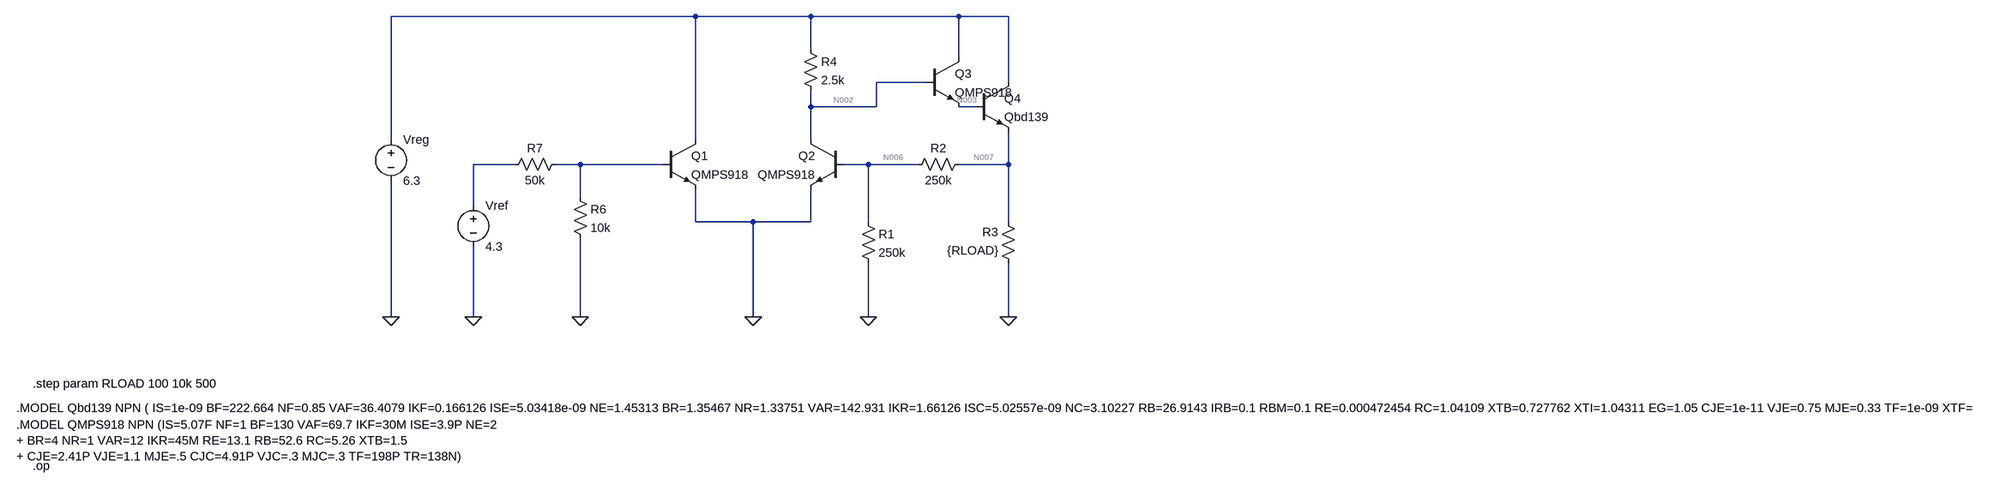
[diagram p0: schematic ReguladorTension-1ite.asc]
ReguladorTension-1ite.asc, the LTspice schematic file:
Version 4
SHEET 1 4348 848
WIRE 64 -96 -528 -96
WIRE 288 -96 64 -96
WIRE 576 -96 288 -96
WIRE 672 -96 576 -96
WIRE 288 -32 288 -96
WIRE 576 -16 576 -96
WIRE 512 32 416 32
WIRE 672 32 672 -96
WIRE 288 80 288 48
WIRE 416 80 416 32
WIRE 416 80 288 80
WIRE 608 80 576 80
WIRE -528 144 -528 -96
WIRE 64 144 64 -96
WIRE 288 144 288 80
WIRE -288 192 -368 192
WIRE -160 192 -208 192
WIRE 0 192 -160 192
WIRE 400 192 352 192
WIRE 496 192 400 192
WIRE 672 192 672 128
WIRE 672 192 576 192
WIRE -160 256 -160 192
WIRE -368 272 -368 192
WIRE 64 304 64 240
WIRE 176 304 64 304
WIRE 288 304 288 240
WIRE 288 304 176 304
WIRE 400 304 400 192
WIRE 672 304 672 192
WIRE -528 496 -528 224
WIRE -368 496 -368 352
WIRE -160 496 -160 336
WIRE 176 496 176 304
WIRE 400 496 400 384
WIRE 672 496 672 384
FLAG 176 496 0
FLAG 672 496 0
FLAG 400 496 0
FLAG -368 496 0
FLAG -528 496 0
FLAG -160 496 0
DATAFLAG 384 -96 ""
DATAFLAG 656 192 ""
DATAFLAG -32 192 "$-V(N008)"
DATAFLAG 368 192 "$-V(N008)"
DATAFLAG 672 0 "$-V(N006)"
SYMBOL npn 0 144 R0
SYMATTR InstName Q1
SYMATTR Value QMPS918
SYMBOL npn 352 144 M0
SYMATTR InstName Q2
SYMATTR Value QMPS918
SYMBOL res 384 288 R0
SYMATTR InstName R1
SYMATTR Value 250k
SYMBOL res 592 176 R90
WINDOW 0 0 56 VBottom 2
WINDOW 3 32 56 VTop 2
SYMATTR InstName R2
SYMATTR Value 250k
SYMBOL res 688 400 R180
WINDOW 0 36 76 Left 2
WINDOW 3 36 40 Left 2
SYMATTR InstName R3
SYMATTR Value {RLOAD}
SYMBOL npn 608 32 R0
SYMATTR InstName Q4
SYMATTR Value Qbd139
SYMBOL voltage -368 256 R0
WINDOW 123 0 0 Left 0
WINDOW 39 0 0 Left 0
SYMATTR InstName Vref
SYMATTR Value 4.3
SYMBOL voltage -528 128 R0
WINDOW 123 0 0 Left 0
WINDOW 39 0 0 Left 0
SYMATTR InstName Vreg
SYMATTR Value 6.3
SYMBOL res 272 -48 R0
SYMATTR InstName R4
SYMATTR Value 2.5k
SYMBOL res -176 240 R0
SYMATTR InstName R6
SYMATTR Value 10k
SYMBOL res -192 176 R90
WINDOW 0 0 56 VBottom 2
WINDOW 3 32 56 VTop 2
SYMATTR InstName R7
SYMATTR Value 50k
SYMBOL npn 512 -16 R0
SYMATTR InstName Q3
SYMATTR Value QMPS918
TEXT -1256 720 Left 2 !.MODEL Qbd139 NPN ( IS=1e-09 BF=222.664 NF=0.85 VAF=36.4079 IKF=0.166126 ISE=5.03418e-09 NE=1.45313 BR=1.35467 NR=1.33751 VAR=142.931 IKR=1.66126 ISC=5.02557e-09 NC=3.10227 RB=26.9143 IRB=0.1 RBM=0.1 RE=0.000472454 RC=1.04109 XTB=0.727762 XTI=1.04311 EG=1.05 CJE=1e-11 VJE=0.75 MJE=0.33 TF=1e-09 XTF=1 VTF=10 ITF=0.01 CJC=1e-11 VJC=0.75 MJC=0.33 XCJC=0.9 FC=0.5 CJS=0 VJS=0.75 MJS=0.5 TR=1e-07 PTF=0 KF=0 AF=1)
TEXT -1224 832 Left 2 !.op
TEXT -1256 752 Left 2 !.MODEL QMPS918 NPN (IS=5.07F NF=1 BF=130 VAF=69.7 IKF=30M ISE=3.9P NE=2\n+ BR=4 NR=1 VAR=12 IKR=45M RE=13.1 RB=52.6 RC=5.26 XTB=1.5\n+ CJE=2.41P VJE=1.1 MJE=.5 CJC=4.91P VJC=.3 MJC=.3 TF=198P TR=138N)
TEXT -1224 672 Left 2 !.step param RLOAD 100 10k 500

The netlist it stands for:
* ReguladorTension-1ite.asc
Q1 N001 N005 0 0 QMPS918
Q2 N002 N006 0 0 QMPS918
R1 N006 0 250k
R2 N007 N006 250k
R3 0 N007 {RLOAD}
Q4 N001 N003 N007 0 Qbd139
Vref N004 0 4.3
Vreg N001 0 6.3
R4 N001 N002 2.5k
R6 N005 0 10k
R7 N005 N004 50k
Q3 N001 N002 N003 0 QMPS918
.model NPN NPN
.model PNP PNP
.lib standard.bjt
.MODEL Qbd139 NPN ( IS=1e-09 BF=222.664 NF=0.85 VAF=36.4079 IKF=0.166126 ISE=5.03418e-09 NE=1.45313 BR=1.35467 NR=1.33751 VAR=142.931 IKR=1.66126 ISC=5.02557e-09 NC=3.10227 RB=26.9143 IRB=0.1 RBM=0.1 RE=0.000472454 RC=1.04109 XTB=0.727762 XTI=1.04311 EG=1.05 CJE=1e-11 VJE=0.75 MJE=0.33 TF=1e-09 XTF=1 VTF=10 ITF=0.01 CJC=1e-11 VJC=0.75 MJC=0.33 XCJC=0.9 FC=0.5 CJS=0 VJS=0.75 MJS=0.5 TR=1e-07 PTF=0 KF=0 AF=1)
.op
.MODEL QMPS918 NPN (IS=5.07F NF=1 BF=130 VAF=69.7 IKF=30M ISE=3.9P NE=2
+ BR=4 NR=1 VAR=12 IKR=45M RE=13.1 RB=52.6 RC=5.26 XTB=1.5
+ CJE=2.41P VJE=1.1 MJE=.5 CJC=4.91P VJC=.3 MJC=.3 TF=198P TR=138N)
.step param RLOAD 100 10k 500
.backanno
.end

* Results of the author's LTspice run, read from the files saved beside the schematic
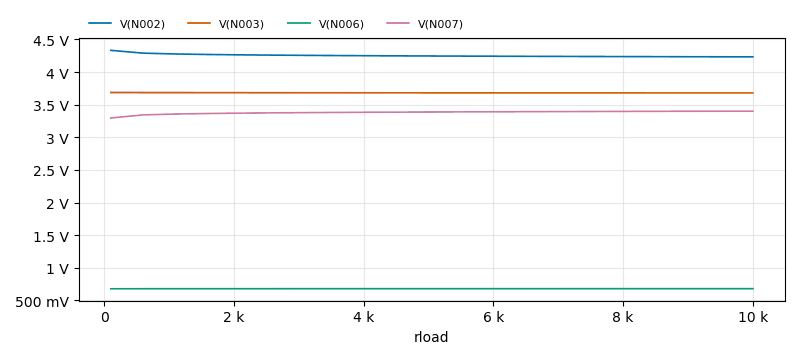
[diagram p1: Operating Point of ReguladorTension-1ite.asc, plotted from the saved traces]
* Operating Point, 1 run:
*   V(N002): 4.333 V at rload=100 , 4.233 V at rload=10 k, min 4.233 V, max 4.333 V
*   V(N003): 3.687 V at rload=100 , 3.68 V at rload=10 k, min 3.68 V, max 3.687 V
*   V(N006): 677.9 mV at rload=100 , 680 mV at rload=10 k, min 677.9 mV, max 680 mV
*   V(N007): 3.296 V at rload=100 , 3.401 V at rload=10 k, min 3.296 V, max 3.401 V
* From the log:
*   Semiconductor Device Operating Points:
*                           --- Bipolar Transistors ---
*   Name:       q4          q3          q2          q1
*   Model:    qbd139      qmps918     qmps918     qmps918
*   Ib:       2.96e-04    3.28e-06    7.76e-06    5.91e-06
*   Ic:       3.27e-02    2.92e-04    7.84e-04    5.98e-04
*   Vbe:      3.91e-01    6.46e-01    6.78e-01    6.67e-01
*   Vbc:     -2.61e+00   -1.97e+00   -3.65e+00   -5.63e+00
*   Vce:      3.00e+00    2.61e+00    4.33e+00    6.30e+00
*   BetaDC:   1.11e+02    8.90e+01    1.01e+02    1.01e+02
*   Gm:       1.29e+00    1.12e-02    2.95e-02    2.26e-02
*   Rpi:      9.15e+01    9.22e+03    3.70e+03    4.94e+03
*   Rx:       2.67e+01    5.26e+01    5.26e+01    5.26e+01
*   Ro:       1.19e+03    2.32e+05    8.87e+04    1.20e+05
*   Cbe:      2.29e-09    5.90e-12    9.61e-12    8.23e-12
*   Cbc:      5.50e-12    2.68e-12    2.27e-12    2.01e-12
*   Cjs:      0.00e+00    0.00e+00    0.00e+00    0.00e+00
*   BetaAC:   1.18e+02    1.03e+02    1.09e+02    1.12e+02
*   Cbx:      6.12e-13    0.00e+00    0.00e+00    0.00e+00
*   Ft:       8.91e+07    2.07e+08    3.95e+08    3.52e+08